# EAGLE schematic 7seg-clock (EAGLE 7.3.0)
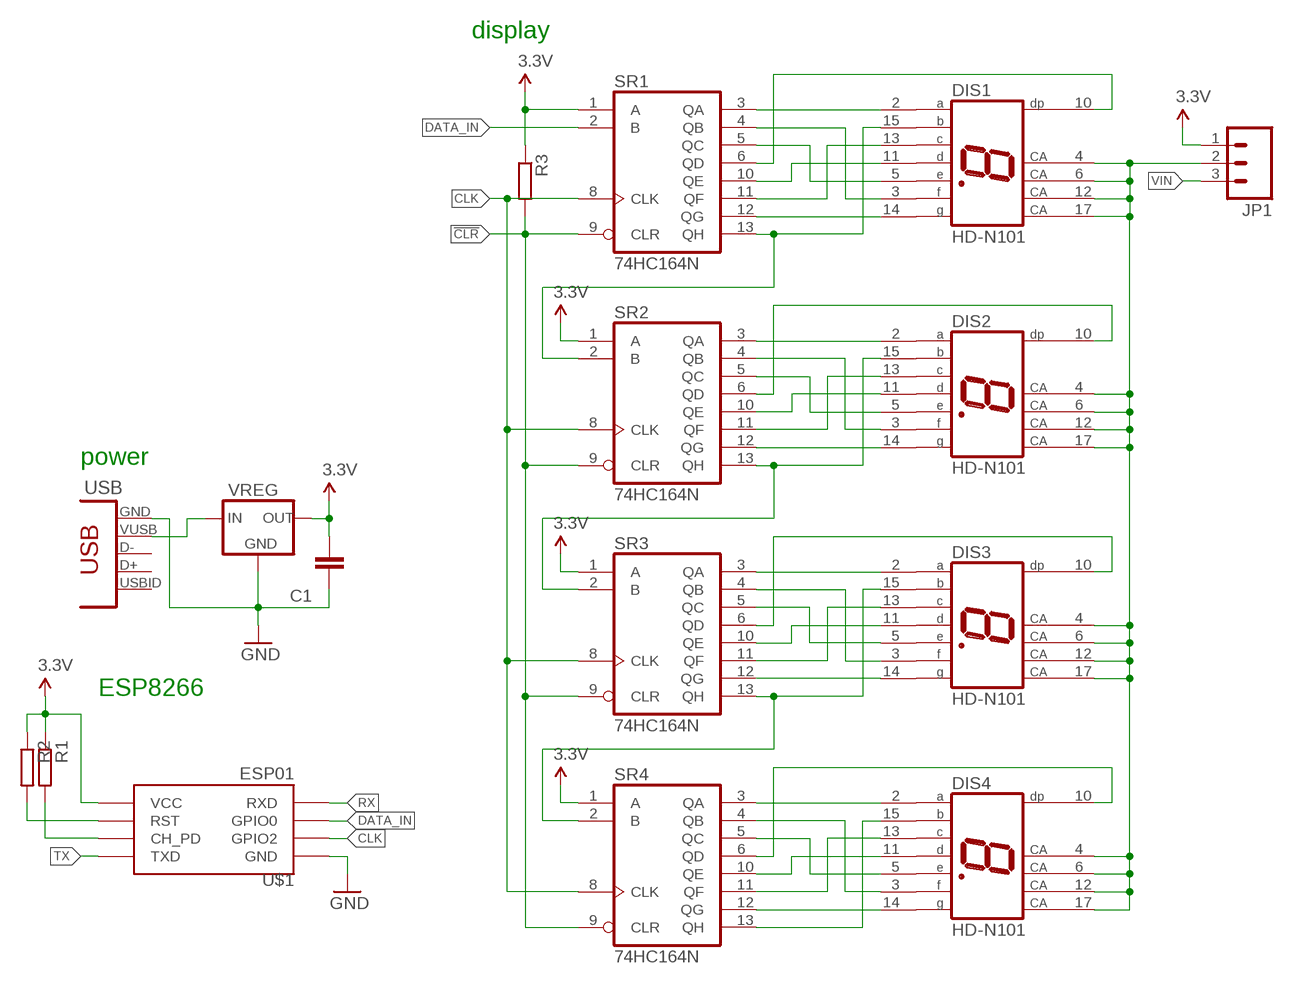
[diagram p0: schematic, sheet 1]

## Parts
C1  CAPACITOR_NPOL-0603  [C603]
DIS1  HD-N101  [HDSP-Q]
DIS2  HD-N101  [HDSP-Q]
DIS3  HD-N101  [HDSP-Q]
DIS4  HD-N101  [HDSP-Q]
JP1  M03PTH  [1X03]
R1  RESISTOR-0603  [R603]
R2  RESISTOR-0603  [R603]
R3  RESISTOR-0603  [R603]
SR1  74HC164N  [DIL14]
SR2  74HC164N  [DIL14]
SR3  74HC164N  [DIL14]
SR4  74HC164N  [DIL14]
U$1  ESP01  [ESP01]
USB  CON-USB-F-MICRO-B  [CONN_USB_MICRO-B]
VREG  V_REG_MIC2920  [SOT223]

## Nets
3.3V: C1.2 JP1.1 R1.1 R2.1 R3.1 SR1.1(A) SR2.1(A) SR3.1(A) SR4.1(A) U$1.VCC VREG.3(OUT)
!CLR: R3.2 SR1.9(CLR) SR2.9(CLR) SR3.9(CLR) SR4.9(CLR)
CLK: SR1.8(CLK) SR2.8(CLK) SR3.8(CLK) SR4.8(CLK) U$1.GPIO2
DATA_IN: SR1.2(B) U$1.GPIO0
GND: C1.1 U$1.GND USB.P5(GND) VREG.2(GND) VREG.4(GND)
N$1: DIS1.15(B) SR1.13(QH) SR2.2(B)
N$2: DIS1.4(CA) DIS1.6(CA) DIS1.12(CA) DIS1.17(CA) DIS2.4(CA) DIS2.6(CA) DIS2.12(CA) DIS2.17(CA) DIS3.4(CA) DIS3.6(CA) DIS3.12(CA) DIS3.17(CA) DIS4.4(CA) DIS4.6(CA) DIS4.12(CA) DIS4.17(CA) JP1.2
N$3: DIS1.2(A) SR1.3(QA)
N$4: DIS1.3(F) SR1.4(QB)
N$5: DIS2.15(B) SR2.13(QH) SR3.2(B)
N$6: DIS3.15(B) SR3.13(QH) SR4.2(B)
N$7: DIS1.11(D) SR1.10(QE)
N$8: DIS1.10(DP) SR1.6(QD)
N$9: DIS1.13(C) SR1.11(QF)
N$10: DIS1.5(E) SR1.5(QC)
N$11: DIS1.14(G) SR1.12(QG)
N$12: DIS2.2(A) SR2.3(QA)
N$13: DIS2.14(G) SR2.12(QG)
N$14: DIS2.10(DP) SR2.6(QD)
N$15: DIS4.5(E) SR4.5(QC)
N$16: DIS2.3(F) SR2.4(QB)
N$17: DIS2.5(E) SR2.5(QC)
N$18: DIS2.13(C) SR2.11(QF)
N$19: DIS2.11(D) SR2.10(QE)
N$20: DIS3.2(A) SR3.3(QA)
N$21: DIS3.14(G) SR3.12(QG)
N$22: DIS3.10(DP) SR3.6(QD)
N$23: DIS4.3(F) SR4.4(QB)
N$24: DIS3.3(F) SR3.4(QB)
N$25: DIS3.5(E) SR3.5(QC)
N$26: DIS3.11(D) SR3.10(QE)
N$27: DIS3.13(C) SR3.11(QF)
N$28: DIS4.2(A) SR4.3(QA)
N$29: DIS4.14(G) SR4.12(QG)
N$30: DIS4.15(B) SR4.13(QH)
N$31: DIS4.10(DP) SR4.6(QD)
N$32: DIS4.11(D) SR4.10(QE)
N$33: DIS4.13(C) SR4.11(QF)
N$35: R1.2 U$1.CH_PD
N$36: R2.2 U$1.RST
RX: U$1.RX(RXD)
TX: U$1.TX(TXD)
VIN: JP1.3 USB.P1(VUSB) VREG.1(IN)
Unconnected: USB.BODY@1(BODY) USB.BODY@2(BODY) USB.BODY@3(BODY) USB.BODY@4(BODY) USB.P2(D-) USB.P3(D+) USB.P4(USBID)

## Notes on the sheet
- display
- power
- ESP8266

## Power pins joined to a net without a drawn wire
GND: SR1.7(GND) SR2.7(GND) SR3.7(GND) SR4.7(GND)
VCC: SR1.14(VCC) SR2.14(VCC) SR3.14(VCC) SR4.14(VCC)

## Library data of the parts
C1 = dp_devices:CAPACITOR_NPOL: Non-Polarized capacitor in various packages
DIS1-DIS4 = display-hp:HD-N101: LED DISPLAY 1-character 7 segment, decimal point right; OC_FARNELL: unknown; OC_NEWARK: unknown
JP1 = SparkFun-Connectors:M03: Header 3 Standard 3-pin 0.1" header. Use with straight break away headers (SKU : PRT-00116), right angle break away headers (PRT-00553), swiss pins (PRT-00743), machine pins (PRT-00117), and female headers (PRT-00115). Molex polarized connector foot print use with SKU : PRT-08232 with associated crimp pins and housings.
R1-R3 = dp_devices:RESISTOR
SR1-SR4 = 74xx-eu:74*164: 8-bit parallel out SHIFT REGISTER
U$1 = esp8266modules:ESP01: ESP8266 Wifi module 01
USB = dp_devices:CON-USB-F: USB Female connector
VREG = SparkFun-PowerIC:V_REG_MIC2920: MIC2920A (http://www.micrel.com/_PDF/mic2920.pdf) - 400mA output LDO Regulator